# Altium project btlATG.PrjPcb
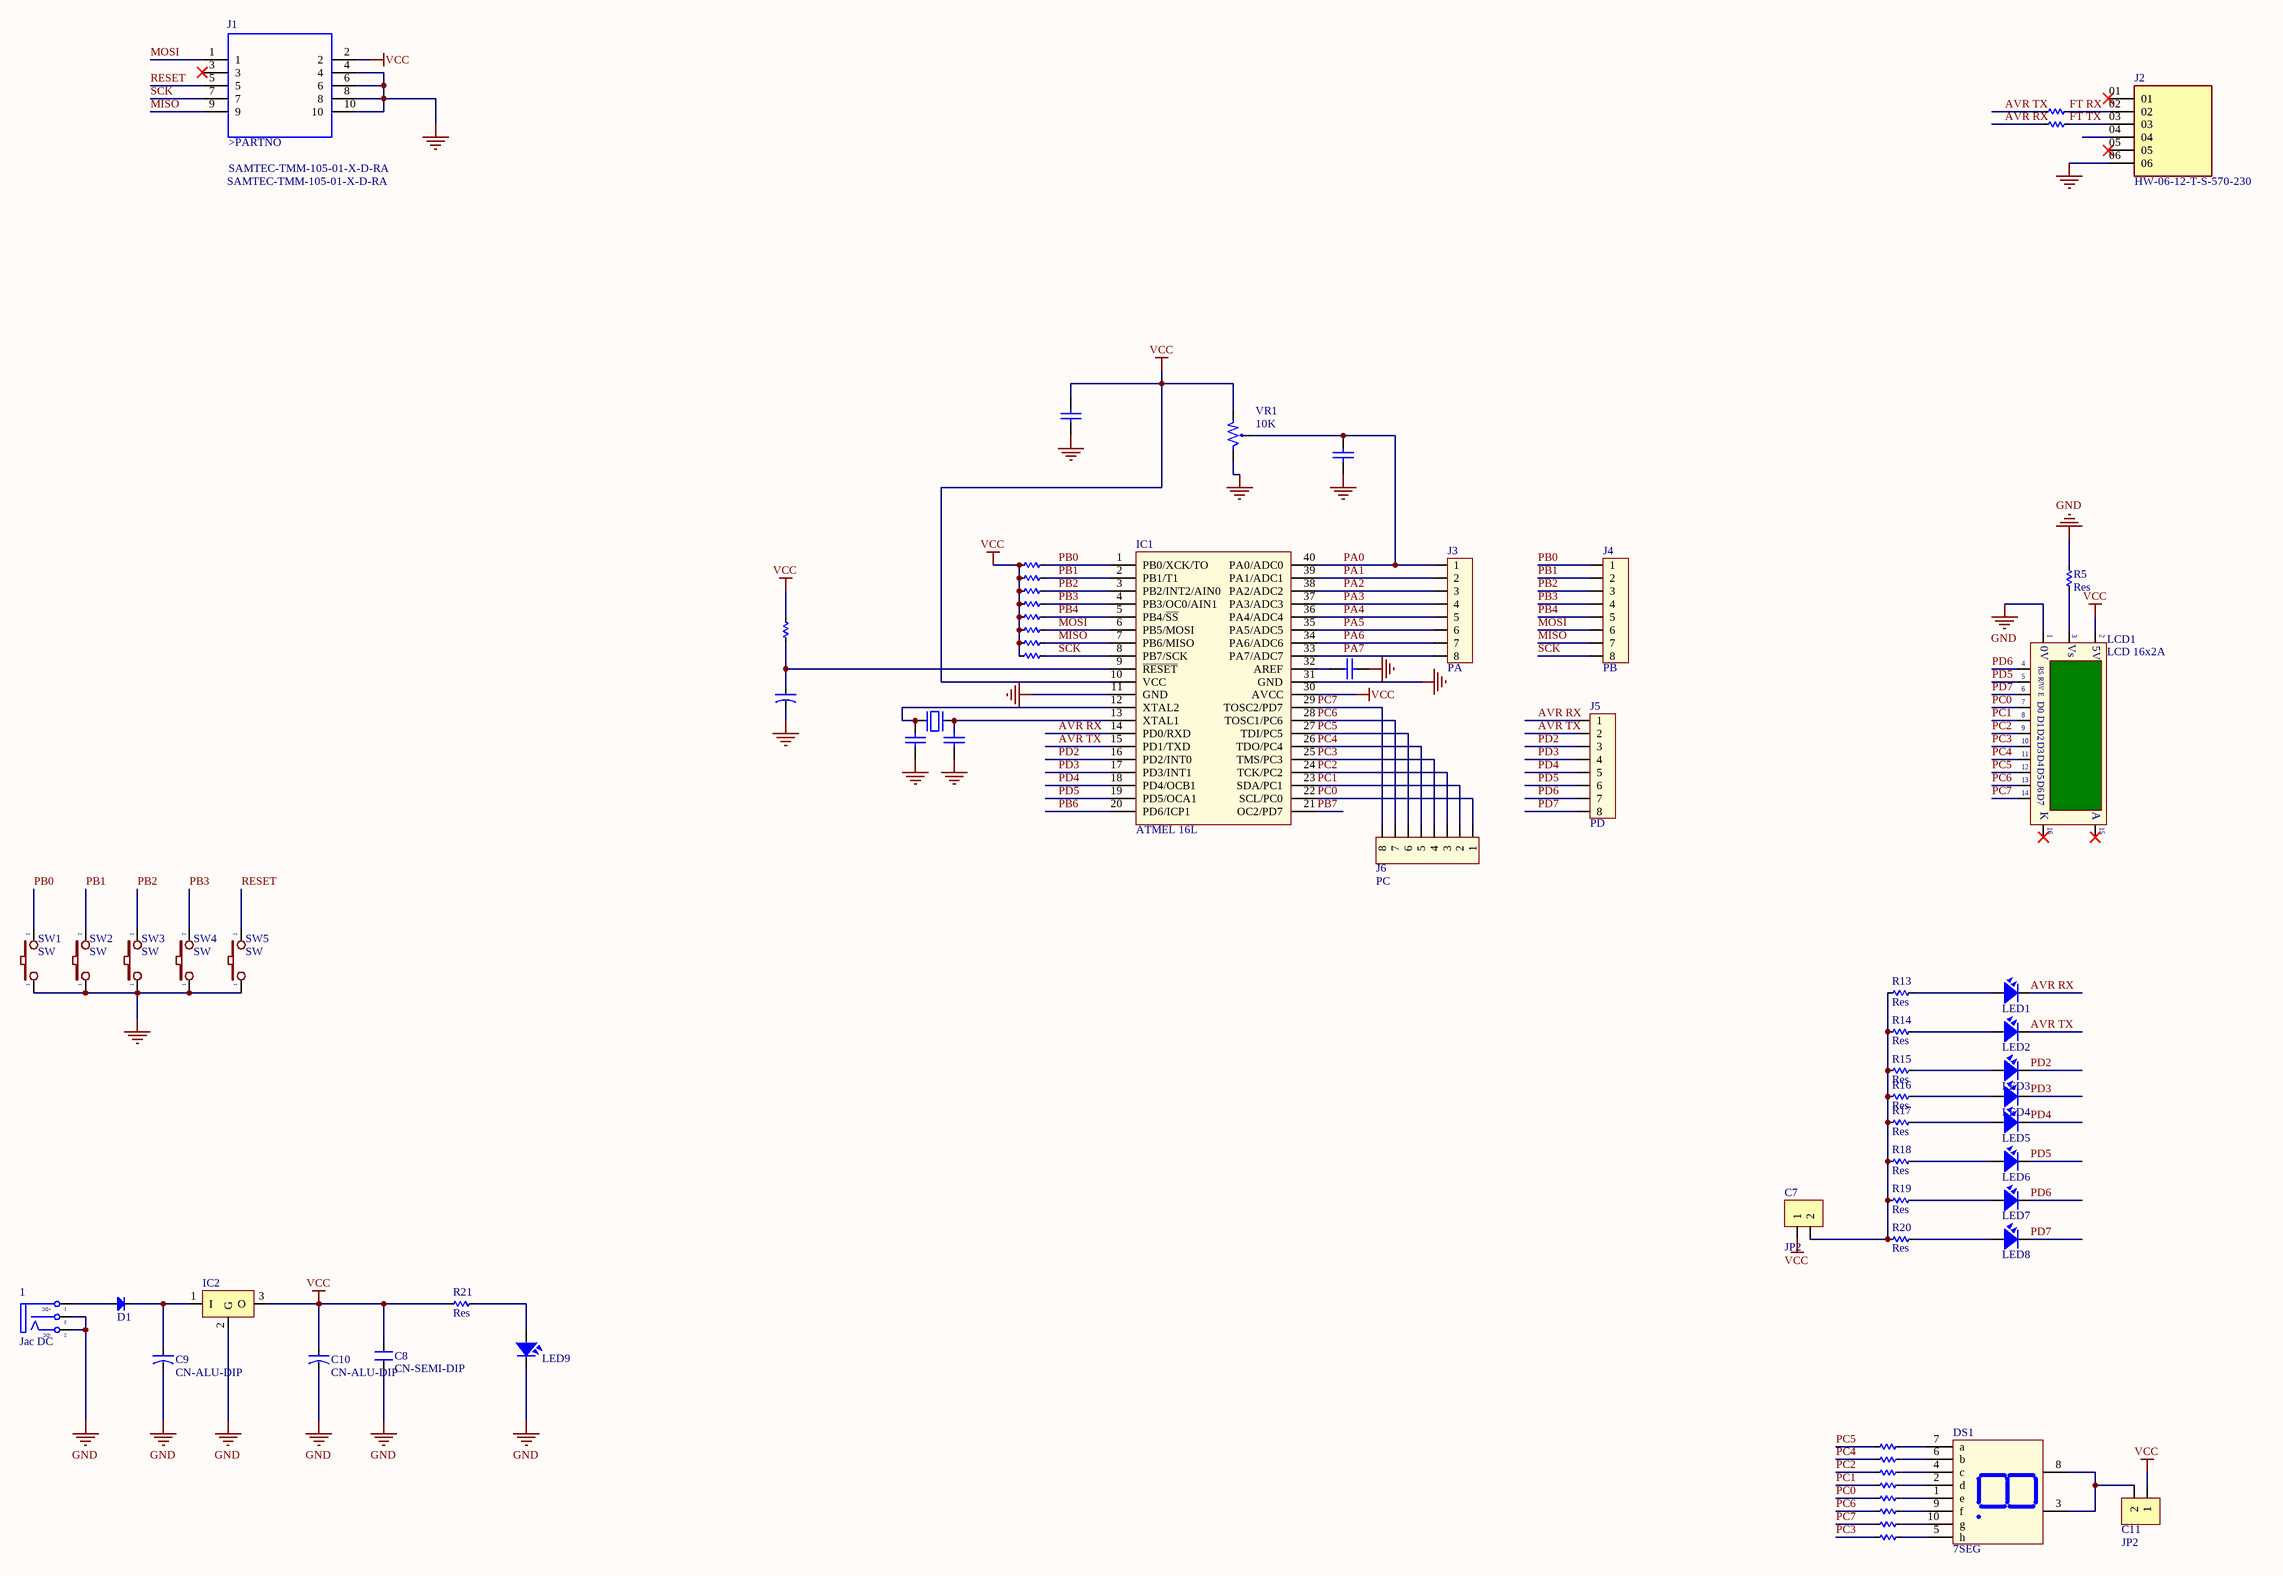
[diagram p0: sche.SchDoc]
1 sheet, 68 parts. Net scope: global (net labels, ports and power ports of the same name join across sheets).
Board file: PCB1.PcbDoc

## Sheet sche.SchDoc
size C; SheetNumber: 1; SheetTotal: 1

### Parts
1  Jac DC  [DC0]
C1  104  [CNP]  (value not drawn)
C2  104  [CNP]  (value not drawn)
C3  104  [CNP]  (value not drawn)
C4  CN-ALU-DIP  [CA-ALU-2.54]  (value not drawn)
C5  104  [CNP]  (value not drawn)
C6  104  [CNP]  (value not drawn)
C7  JP2  [JP2-C1T]
C8  CN-SEMI-DIP  [C-SE-7,5x10x9x5x4]
C9  CN-ALU-DIP  [CA-ALU-2.54]
C10  CN-ALU-DIP  [CA-ALU-2.54]
C11  JP2  [JP2-C1T]
D1  Diode  [DIO-1A]  (value not drawn)
DS1  7SEG  [LED7SEG-1-0.56]
IC1  ATMEL 16L  [DIP40/W0.6]
IC2  LM78xx  [TO220-123]  (value not drawn)
J1  SAMTEC-TMM-105-01-X-D-RA  [SAMTEC-TMM-105-01-X-D-RA]
J2  HW-06-12-T-S-570-230  [SAMTEC_HW-06-12-T-S-570-230]
J3  PA  [Header8]
J4  PB  [Header8]
J5  PD  [Header8]
J6  PC  [Header8]
LCD1  LCD 16x2A  [JP16-C1T]
LED1  LED  [LED-3MM-YELLOW]  (value not drawn)
LED2  LED  [LED-3MM-YELLOW]  (value not drawn)
LED3  LED  [LED-3MM-YELLOW]  (value not drawn)
LED4  LED  [LED-3MM-YELLOW]  (value not drawn)
LED5  LED  [LED-3MM-YELLOW]  (value not drawn)
LED6  LED  [LED-3MM-YELLOW]  (value not drawn)
LED7  LED  [LED-3MM-YELLOW]  (value not drawn)
LED8  LED  [LED-3MM-YELLOW]  (value not drawn)
LED9  LED  [LED-3MM-YELLOW]  (value not drawn)
R1  10K  [RES-SMD-0805]  (value not drawn)
R2  10K  [RES-SMD-0805]  (value not drawn)
R3  10K  [RES-SMD-0805]  (value not drawn)
R4  Res  [RES-SMD-0805]  (value not drawn)
R5  Res  [RES-SMD-0805]
R6  Res  [RES-SMD-0805]  (value not drawn)
R7  Res  [RES-SMD-0805]  (value not drawn)
R8  Res  [RES-SMD-0805]  (value not drawn)
R9  Res  [RES-SMD-0805]  (value not drawn)
R10  Res  [RES-SMD-0805]  (value not drawn)
R11  Res  [RES-SMD-0805]  (value not drawn)
R12  Res  [RES-SMD-0805]  (value not drawn)
R13  Res  [RES-SMD-0805]
R14  Res  [RES-SMD-0805]
R15  Res  [RES-SMD-0805]
R16  Res  [RES-SMD-0805]
R17  Res  [RES-SMD-0805]
R18  Res  [RES-SMD-0805]
R19  Res  [RES-SMD-0805]
R20  Res  [RES-SMD-0805]
R21  Res  [RES-SMD-0805]
R22  Res  [RES-SMD-0805]  (value not drawn)
R23  Res  [RES-SMD-0805]  (value not drawn)
R24  Res  [RES-SMD-0805]  (value not drawn)
R25  Res  [RES-SMD-0805]  (value not drawn)
R26  Res  [RES-SMD-0805]  (value not drawn)
R27  Res  [RES-SMD-0805]  (value not drawn)
R28  Res  [RES-SMD-0805]  (value not drawn)
R29  Res  [RES-SMD-0805]  (value not drawn)
SW1  SW  [SW2]
SW2  SW  [SW2]
SW3  SW  [SW2]
SW4  SW  [SW2]
SW5  SW  [SW2]
VR1  10K  [VR]
X1  12Mhz  [XT2]  (value not drawn)

### Nets
GND: 1.2(TN) 1.3(S) C1.2 C2.2 C3.1 C4.2 C5.1 C6.1 C8.1 C9.2 C10.2 IC1.11(GND) IC1.31(GND) IC2.2(G) J1.4 J1.6 J1.8 J1.10 J2.06 LCD1.1(GND) LED9.2 R5.1 SW1.1 SW2.1 SW3.1 SW4.1 SW5.1 VR1.3
VCC: C1.1 C7.1 C8.2 C10.1 C11.1 IC1.10(VCC) IC1.30(AVCC) IC2.3(O) J1.2 LCD1.2(VDD) R3.2 R4.2 R6.2 R7.2 R8.2 R9.2 R10.1 R11.2 R12.2 R21.2 VR1.1
AVR RX: IC1.14(PD0/RXD) J5.1 LED1.2 R2.2
AVR TX: IC1.15(PD1/TXD) J5.2 LED2.2 R1.2
FT RX: J2.02 R1.1
FT TX: J2.03 R2.1
MISO: IC1.7(PB6/MISO) J1.9 J4.7 R11.1
MOSI: IC1.6(PB5/MOSI) J1.1 J4.6 R9.1
PA0: C2.1 IC1.40(PA0/ADC0) J3.1 VR1.2
PA1: IC1.39(PA1/ADC1) J3.2
PA2: IC1.38(PA2/ADC2) J3.3
PA3: IC1.37(PA3/ADC3) J3.4
PA4: IC1.36(PA4/ADC4) J3.5
PA5: IC1.35(PA5/ADC5) J3.6
PA6: IC1.34(PA6/ADC6) J3.7
PA7: IC1.33(PA7/ADC7) J3.8
PB0: IC1.1(PB0/XCK/TO) J4.1 R3.1 SW1.2
PB1: IC1.2(PB1/T1) J4.2 R4.1 SW2.2
PB2: IC1.3(PB2/INT2/AIN0) J4.3 R6.1 SW3.2
PB3: IC1.4(PB3/OC0/AIN1) J4.4 R7.1 SW4.2
PB4: IC1.5(PB4/~{SS}) J4.5 R8.1
PB6: IC1.20(PD6/ICP1)
PB7: IC1.21(OC2/PD7)
PC0: IC1.22(SCL/PC0) J6.1 LCD1.7(D0) R26.2
PC1: IC1.23(SDA/PC1) J6.2 LCD1.8(D1) R25.2
PC2: IC1.24(TCK/PC2) J6.3 LCD1.9(D2) R24.2
PC3: IC1.25(TMS/PC3) J6.4 LCD1.10(D3) R29.2
PC4: IC1.26(TDO/PC4) J6.5 LCD1.11(D4) R23.2
PC5: IC1.27(TDI/PC5) J6.6 LCD1.12(D5) R22.2
PC6: IC1.28(TOSC1/PC6) J6.7 LCD1.13(D6) R27.2
PC7: IC1.29(TOSC2/PD7) J6.8 LCD1.14(D7) R28.2
PD2: IC1.16(PD2/INT0) J5.3 LED3.2
PD3: IC1.17(PD3/INT1) J5.4 LED4.2
PD4: IC1.18(PD4/OCB1) J5.5 LED5.2
PD5: IC1.19(PD5/OCA1) J5.6 LCD1.5(R/~{W}) LED6.2
PD6: J5.7 LCD1.4(RS) LED7.2
PD7: J5.8 LCD1.6(~{EN}) LED8.2
RESET: J1.5 SW5.2
SCK: IC1.8(PB7/SCK) J1.7 J4.8 R12.1
Net1_1: 1.1(T) D1.1(A)
NetC3_2: C3.2 IC1.32(AREF)
NetC4_1: C4.1 IC1.9(~{RESET}) R10.2
NetC5_2: C5.2 IC1.12(XTAL2) X1.1
NetC6_2: C6.2 IC1.13(XTAL1) X1.2
NetC7_2: C7.2 R13.2 R14.2 R15.2 R16.2 R17.2 R18.2 R19.2 R20.2
NetC9_1: C9.1 D1.2(K) IC2.1(I)
NetC11_2: C11.2 DS1.3(Vcc) DS1.8(Vcc)
NetDS1_1: DS1.1(e) R26.1
NetDS1_2: DS1.2(d) R25.1
NetDS1_4: DS1.4(c) R24.1
NetDS1_5: DS1.5(h) R29.1
NetDS1_6: DS1.6(b) R23.1
NetDS1_7: DS1.7(a) R22.1
NetDS1_9: DS1.9(f) R27.1
NetDS1_10: DS1.10(g) R28.1
NetLCD1_3: LCD1.3(VEE) R5.2
NetLED1_1: LED1.1 R13.1
NetLED2_1: LED2.1 R14.1
NetLED3_1: LED3.1 R15.1
NetLED4_1: LED4.1 R16.1
NetLED5_1: LED5.1 R17.1
NetLED6_1: LED6.1 R18.1
NetLED7_1: LED7.1 R19.1
NetLED8_1: LED8.1 R20.1
NetLED9_1: LED9.1 R21.1

Not connected (* = marked no-connect by the designer): J1 3*; J2 01* 04 05*; LCD1 15(A)* 16(K)*

### Notes on the sheet
- (in symbol DCIN) +DC; -DC
- (in symbol LCD16x2A) 0V; Vs; 5V; R/W; |; E
- (in symbol SAMTEC-TMM-105-01-X-D-RA) >PARTNO

### Library data of the parts
1 = DCIN: Jac DC input; Value: Jac DC
C1-C3 C5 C6 = Cap Semi: Capacitor (Semiconductor SIM Model); VALUE: CN?; LatestRevisionDate: 17-Jul-2002; LatestRevisionNote: Re-released for DXP Platform.; PackageReference: C1206; Publisher: Altium Limited; Value: 104
C4 C9 C10 = CN-ALU-DIP: Capacitor (Semiconductor SIM Model); Value: 104; LatestRevisionDate: 17-Jul-2002; LatestRevisionNote: Re-released for DXP Platform.; PackageReference: C1206; Publisher: Altium Limited
C7 C11 = JP2: WR-PHD 2.54 mm Angled Socket Header; Manufacturer: W¨¹rth Elektronik eiSos GmbH; partNo: 613002143121; ComponentLink1 Description: Manufacturer; ComponentLink2 Description: Datasheet; NoPins: 02; Created Date: 29 March 2013; ComponentLink1URL: http://www.we-online.com; ComponentLink2URL: http://katalog.we-online.de/em/datasheet/6130xx143121.pdf; Created by: Karrer Zheng
C8 = CN-SEMI-DIP: Capacitor (Semiconductor SIM Model); Value: 104; LatestRevisionDate: 17-Jul-2002; LatestRevisionNote: Re-released for DXP Platform.; PackageReference: C1206; Publisher: Altium Limited
D1 = Diode: Default Diode; Code - JEDEC: DO-214-AB; Value: 1N5007; Published: 8-Jun-2000; Revision: July-2002: Re-released for DXP Platform.; Publisher: Altium Limited
DS1 = LED7SEG-1: 14.2 mm General Purpose Blue 7-Segment Display: CC, RH DP, Gray Surface; MinimumIntensity: 2020 ucd; Note: IF = 10 mA; Published: 8-Jun-2000; LatestRevisionDate: 17-Dec-2003; LatestRevisionNote: Schematic revised, PCB Footprint replaced.; DatasheetDocument: 24-Sep-2002; PackageDocument: 24-Sep-2002; PackageReference: H; Publisher: Altium Limited; Colour: Blue; ComponentLink1Description: Manufacturer Link; ComponentLink1URL: http://www.agilent.com/
IC1 = Atmega16L: 8-Bit AVR Microcontroller with 16K Bytes of In-System Programmable Flash Memory; Value: Atmega 16L
IC2 = LM78xx: Positive Voltage Regulator; Note: Tab is connected to pin 3 (GND).; Published: 24-Aug-2001; LatestRevisionDate: 17-Jul-2002; LatestRevisionNote: Re-released for DXP Platform.; DatasheetVersion: Apr-1994; PackageVersion: Jul-1998; PackageReference: ISOWATT220AB; Publisher: Altium Limited; PackageDescription: TO, Thru-Hole, Vertical, Heatsink Mounted; 3 In-Line Leads; Pitch 2.54 mm; Pin sequence 1, 3, 2; ComponentLink1Description: Manufacturer Link; ComponentLink1URL: http://www.st.com/; ComponentLink2Description: Datasheet; ComponentLink2URL: http://www.st.com/stonline/products/literature/ds/2146/l78m05c.pdf
J1 = SAMTEC-TMM-105-01-X-D-RA: MF: Samtec; Price: None; Availability: Unavailable; MP: SAMTEC-TMM-105-01-X-D-RA; Package: None; Value: *
J3-J6 = Header8: Connector 8; Value: Connector 8
LCD1 = LCD16x2A: LCD dipslay 16 char, 2 line; Value: LCD16x2A
LED1-LED9 = LED: LED Single colour Green and Red; Value: LED 3 ly Single Colour
R1-R3 = Res-SMD: R3; Manufacturer: Generic Components; Class: Passive; Published: 08/06/2000; Publisher: Altium Hobart Technology Centre
R4-R29 = Res-SMD: Resistor; Manufacturer: Generic Components; Class: Passive; Published: 08/06/2000; Publisher: Altium Hobart Technology Centre
SW1-SW5 = SW2: Switch button 2 pin; Value: SW chip 2 pin
VR1 = VR1: Var Resistor; Value: VR 10K
X1 = XT2: Crystal, 32.768 KHz, -40 to 85 degC, 3.2 x 1.5 x 0.9 mm SMD; Value: 4Mhz
J2 = HW-06-12-T-S-570-230: Package: None; Price: None; Value: *; MP: HW-06-12-T-S-570-230; Availability: Unavailable